# Altium schematic sheet Sheet1.SchDoc
size A3
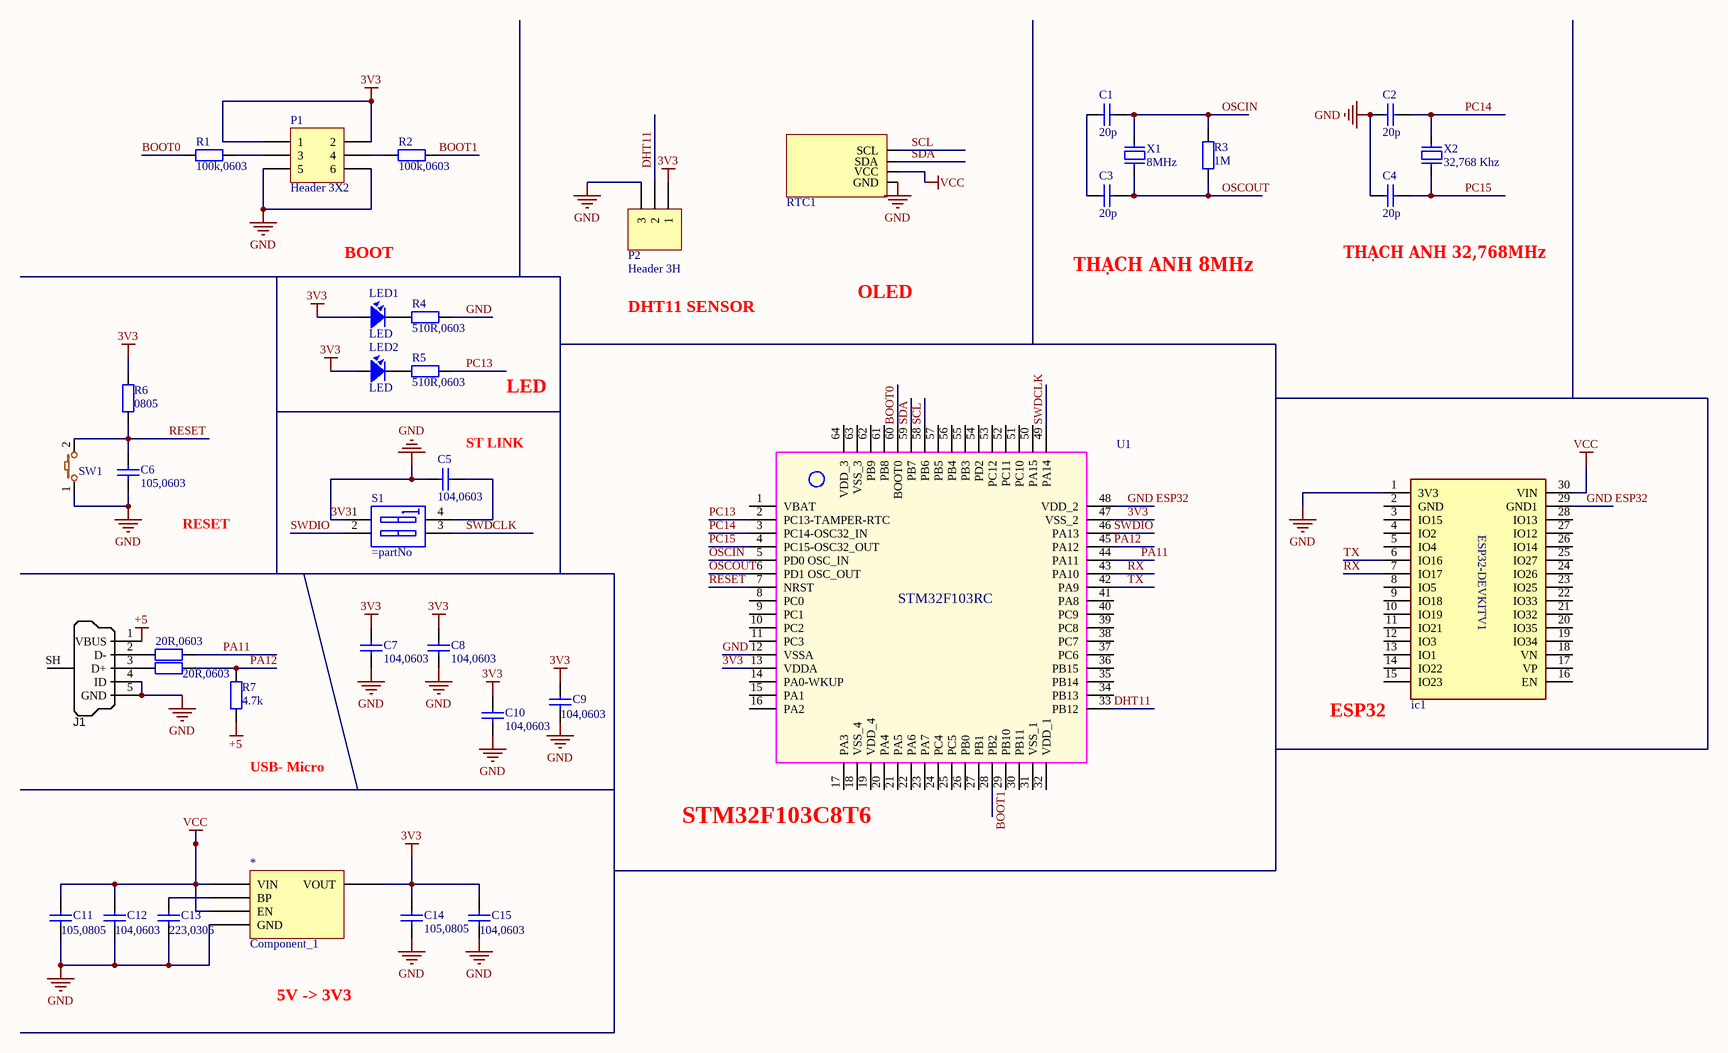
[diagram p0: Sheet1.SchDoc]

## Parts
(Parts that share a designator on the sheet are numbered #1, #2 ... from top to bottom, then left to right.)
20R,0603#1  R0805  [DIEN TRO 0805]  (value not drawn)
20R,0603#2  R0805  [DIEN TRO 0805]  (value not drawn)
*  Component_1
C1  20p  [C1206]
C2  20p  [C1206]
C3  20p  [C1206]
C4  20p  [C1206]
C5  104,0603  [C1206]
C6  105,0603  [C1206]
C7  104,0603  [C1206]
C8  104,0603  [C1206]
C9  104,0603  [C1206]
C10  104,0603  [C1206]
C11  105,0805  [C1206]
C12  104,0603  [C1206]
C13  223,0306  [C1206]
C14  105,0805  [C1206]
C15  104,0603  [C1206]
ic1  ESP32 DevKit 30Pin  [ESP32 DevKit V1 30Pin Thap]  (value not drawn)
J1  USB Micro Type B  [USB_Micro-B_Molex_SMD]  (value not drawn)
LED1  LED  [LED-3]
LED2  LED  [LED-3]
P1  Header 3X2  [HDR2X3]
P2  Header 3H  [HDR1X3H]
R1  value 100k,0603  [DIEN TRO 0805]  (hidden comment: R0805)
R2  value 100k,0603  [DIEN TRO 0805]  (hidden comment: R0805)
R3  value 1M  [DIEN TRO 0805]  (hidden comment: R0805)
R4  value 510R,0603  [DIEN TRO 0805]  (hidden comment: R0805)
R5  value 510R,0603  [DIEN TRO 0805]  (hidden comment: R0805)
R6  value 0805  [DIEN TRO 0805]  (hidden comment: R0805)
R7  value 4.7k  [DIEN TRO 0805]  (hidden comment: R0805)
RTC1  RTC  [DS3231_1]  (value not drawn)
S1  (no value)  [SW-DIP2]
SW1  Nut nhan 7mm  [Push Button 7mm]  (value not drawn)
U1  STM32F103C8T6  [STM32F103RC_TSQFP]  (value not drawn)
X1  8MHz  [XT32k]
X2  32,768 Khz  [XT32k]

## Nets
3V3: *.185(GND) *.186(VOUT) C2.1 C4.1 C5.2 C6.1 C7.1 C7.2 C8.1 C8.2 C9.1 C9.2 C10.1 C10.2 C11.1 C12.1 C13.1 C14.1 C14.2 C15.1 C15.2 ic1.1(3V3) J1.4(ID) J1.5(GND) LED1.1 LED2.1 P1.1 P1.2 P1.5 P1.6 P2.1 P2.3 R4.2 R6.1 RTC1.1(GND) S1.1 SW1.1 U1.12(VSSA) U1.13(VDDA) U1.47(VSS_2)  [also labelled GND]
+5: J1.1(VBUS) R7.1
VCC: *.182(VIN) *.184(EN) C11.2 C12.2 ic1.30(VIN) RTC1.2(VCC)
BOOT0: R1.1 U1.60(BOOT0)
BOOT1: R2.2 U1.28(PB2)
DHT11: P2.2 U1.33(PB12)
GND ESP32: ic1.29(GND1) U1.48(VDD_2)
OSCIN: C1.1 R3.2 U1.5(PD0_OSC_IN) X1.2
OSCOUT: C3.2 R3.1 U1.6(PD1_OSC_OUT) X1.1
PA11: 20R,0603#1.1 U1.44(PA11)
PA12: 20R,0603#2.1 R7.2 U1.45(PA12)
PC13: R5.2 U1.2(PC13-TAMPER-RTC)
PC14: C2.2 U1.3(PC14-OSC32_IN) X2.2
PC15: C4.2 U1.4(PC15-OSC32_OUT) X2.1
RESET: C6.2 R6.2 SW1.2 U1.7(NRST)
RX: ic1.7(IO17) U1.43(PA10)
SCL: RTC1.4(SCL) U1.58(PB6)
SDA: RTC1.3(SDA) U1.59(PB7)
SWDCLK: S1.3 U1.49(PA14)
SWDIO: S1.2 U1.46(PA13)
TX: ic1.6(IO16) U1.42(PA9)
Net20R,0603#1_2: 20R,0603#1.2 J1.2(D-)
Net20R,0603#2_2: 20R,0603#2.2 J1.3(D+)
Net*_183: *.183(BP) C13.2
NetC1_2: C1.2 C3.1
NetC5_1: C5.1 S1.4
NetLED1_2: LED1.2 R4.1
NetLED2_2: LED2.2 R5.1
NetP1_3: P1.3 R1.2
NetP1_4: P1.4 R2.1

Not connected (* = marked no-connect by the designer): ic1 2(GND) 3(IO15) 4(IO2) 5(IO4) 8(IO5) 9(IO18) 10(IO19) 11(IO21) 12(IO3) 13(IO1) 14(IO22) 15(IO23) 16(EN) 17(VP) 18(VN) 19(IO34) 20(IO35) 21(IO32) 22(IO33) 23(IO25) 24(IO26) 25(IO27) 26(IO14) 27(IO12) 28(IO13); J1 SH(Shell); U1 1(VBAT) 8(PC0) 9(PC1) 10(PC2) 11(PC3) 14(PA0-WKUP) 15(PA1) 16(PA2) 17(PA3) 18(VSS_4) 19(VDD_4) 20(PA4) 21(PA5) 22(PA6) 23(PA7) 24(PC4) 25(PC5) 26(PB0) 27(PB1) 29(PB10) 30(PB11) 31(VSS_1) 32(VDD_1) 34(PB13) 35(PB14) 36(PB15) 37(PC6) 38(PC7) 39(PC8) 40(PC9) 41(PA8) 50(PA15) 51(PC10) 52(PC11) 53(PC12) 54(PD2) 55(PB3) 56(PB4) 57(PB5) 61(PB8) 62(PB9) 63(VSS_3) 64(VDD_3)

## Notes on the sheet
- BOOT
- OLED
- THẠCH ANH 8MHz
- (near C4) THẠCH ANH 32,768MHz
- DHT11 SENSOR
- LED
- (near C5) ST LINK
- RESET
- (near R7) USB- Micro
- (near ic1) ESP32
- (near U1) STM32F103C8T6
- 5V -> 3V3
- (in symbol ESP32 DevKit 30Pin) ESP32-DEVKITV1

## Library data of the parts
20R,0603#1 20R,0603#2 R1-R7 = R0805: Resistor SMD 0805; Published: 8-Jun-2000; LatestRevisionDate: 17-Jul-2002; LatestRevisionNote: Re-released for DXP Platform.; PackageReference: AXIAL-0.4; Publisher: Altium Limited
C1-C15 = Cap SMD 1206
J1 = USB_Micro_TypeB: Connector SMD USB Micro Type B middle mount; Manufacturer 1: Molex Inc; Manufacturer Part Number 1: 47491-0001; SCDType: undef; Package / Case: SMD; Supplier 1: Digi-Key; Supplier Part Number 1: WM17142CT-ND
LED1 LED2 = LED: LED Single colour Green and Red; Value: LED 3 ly Single Colour
P1 = Header 3X2: Header, 3-Pin, Dual row; LatestRevisionDate: 17-Jul-2002; LatestRevisionNote: Re-released for DXP Platform.; Publisher: Altium Limited
P2 = Header 3H: Header, 3-Pin, Right Angle; LatestRevisionDate: 17-Jul-2002; LatestRevisionNote: Re-released for DXP Platform.; Publisher: Altium Limited
S1 = SWDIP2: WS-DITV 2.54 mm small compact THT flat actuator with top tape; Manufacturer: Wurth Elektronik; Part No.: 418127160902; ComponentLink1 Description: Manufacturer; ComponentLink2 Description: Datasheet; Pole: 02; Created Date: Dec.2015; ComponentLink1URL: http://www.we-online.com; ComponentLink2URL: http://katalog.we-online.de/em/datasheet/4181271609xx.pdf; Created by: Baojun Chen
SW1 = Button
U1 = STM32F103RC: Performance line, ARM-based 32-bit MCU with up to 512 KB Flash,  USB, CAN, 11 timers, 3 ADCs and 13 communication interfaces; Value: STM32F103RC
X1 X2 = XT32k: Crystal 32,768kHz for timer real; Value: 32,768khz